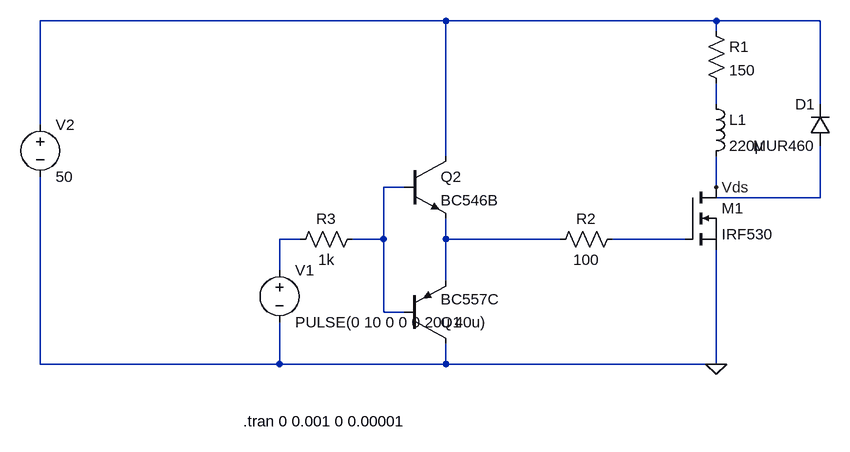
[diagram p0: schematic boost.asc]
boost.asc, the LTspice schematic file:
Version 4
SHEET 1 904 744
WIRE 48 112 -576 112
WIRE 464 112 48 112
WIRE 624 112 464 112
WIRE 464 128 464 112
WIRE 464 240 464 208
WIRE 624 240 624 112
WIRE -576 272 -576 112
WIRE 48 320 48 112
WIRE -16 368 -48 368
WIRE 464 368 464 320
WIRE 624 384 624 304
WIRE 624 384 464 384
WIRE -176 448 -208 448
WIRE -48 448 -48 368
WIRE -48 448 -96 448
WIRE 48 448 48 416
WIRE 224 448 48 448
WIRE 416 448 304 448
WIRE -208 496 -208 448
WIRE 48 512 48 448
WIRE -48 560 -48 448
WIRE -16 560 -48 560
WIRE -576 640 -576 352
WIRE -208 640 -208 576
WIRE -208 640 -576 640
WIRE 48 640 48 608
WIRE 48 640 -208 640
WIRE 464 640 464 464
WIRE 464 640 48 640
FLAG 464 640 0
FLAG 464 368 Vds
SYMBOL nmos 416 368 R0
SYMATTR InstName M1
SYMATTR Value IRF530
SYMBOL res 320 432 R90
WINDOW 0 0 56 VBottom 2
WINDOW 3 32 56 VTop 2
SYMATTR InstName R2
SYMATTR Value 100
SYMBOL pnp -16 608 M180
SYMATTR InstName Q1
SYMATTR Value BC557C
SYMBOL npn -16 320 R0
SYMATTR InstName Q2
SYMATTR Value BC546B
SYMBOL voltage -208 480 R0
WINDOW 123 0 0 Left 0
WINDOW 39 0 0 Left 0
SYMATTR InstName V1
SYMATTR Value PULSE(0 10 0 0 0 20u 40u)
SYMBOL voltage -576 256 R0
WINDOW 123 0 0 Left 0
WINDOW 39 0 0 Left 0
SYMATTR InstName V2
SYMATTR Value 50
SYMBOL res -80 432 R90
WINDOW 0 0 56 VBottom 2
WINDOW 3 32 56 VTop 2
SYMATTR InstName R3
SYMATTR Value 1k
SYMBOL res 448 112 R0
SYMATTR InstName R1
SYMATTR Value 150
SYMBOL ind 448 224 R0
SYMATTR InstName L1
SYMATTR Value 220µ
SYMBOL diode 640 304 R180
WINDOW 0 24 64 Left 2
WINDOW 3 24 0 Left 2
SYMATTR InstName D1
SYMATTR Value MUR460
TEXT -264 728 Left 2 !.tran 0 0.001 0 0.00001

The netlist it stands for:
* boost.asc
M1 Vds N007 0 0 IRF530
R2 N007 N006 100
Q1 0 N003 N006 0 BC557C
Q2 N001 N003 N006 0 BC546B
V1 N005 0 PULSE(0 10 0 0 0 20u 40u)
V2 N001 0 50
R3 N003 N005 1k
R1 N001 N002 150
L1 N002 Vds 220µ
D1 N004 N001 MUR460
.model D D
.lib standard.dio
.model NPN NPN
.model PNP PNP
.lib standard.bjt
.model NMOS NMOS
.model PMOS PMOS
.lib standard.mos
.tran 0 0.001 0 0.00001
.backanno
.end